# EAGLE design Main Board -v1.1 (EAGLE 7.3.0)
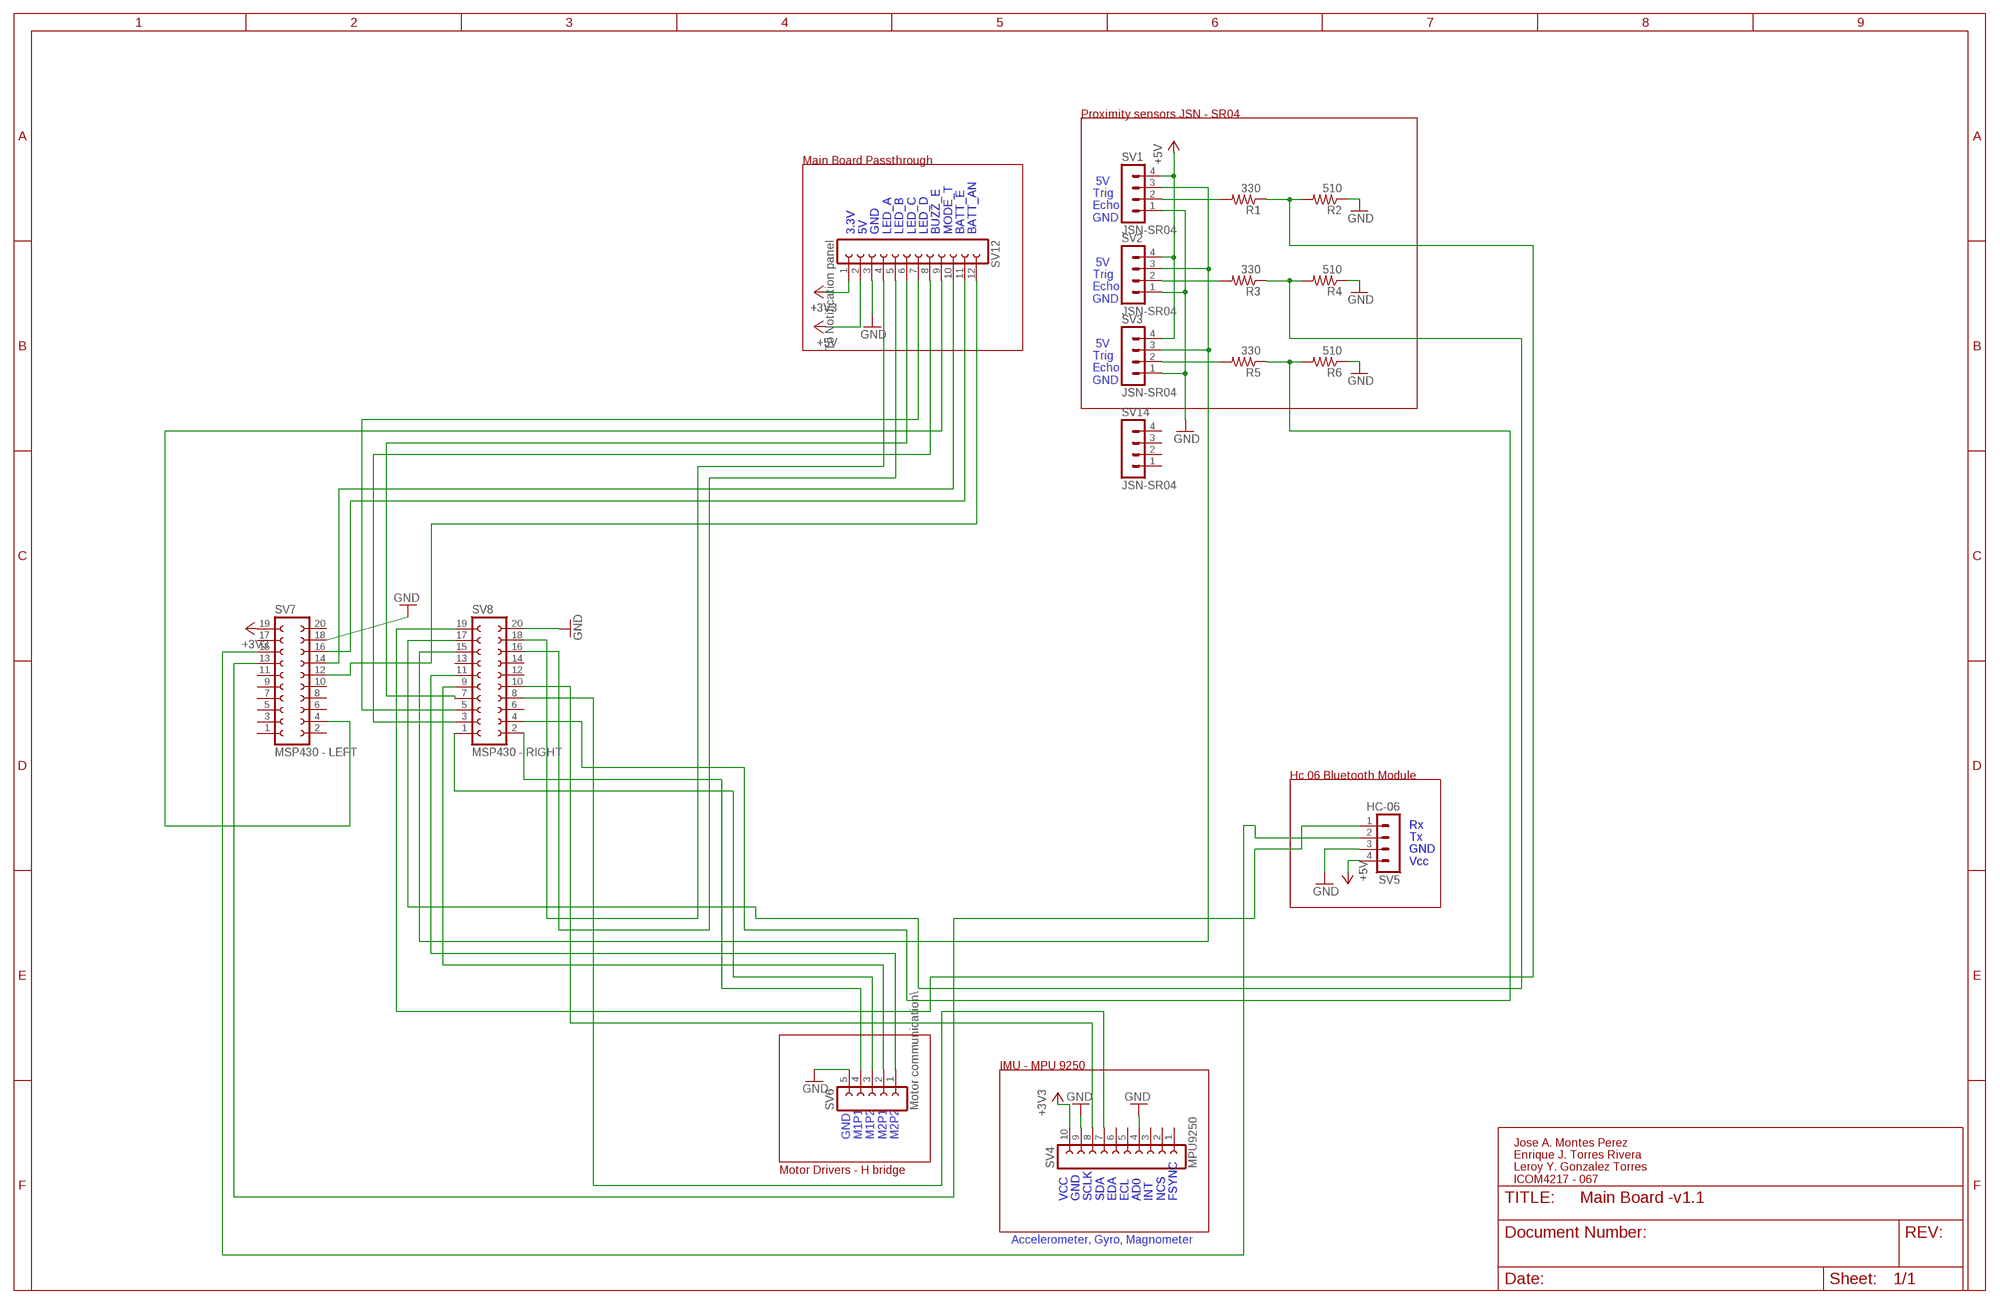
[diagram p0: schematic, sheet 1]

## Parts
R1  330  R-US_0207/10  [0207/10]
R2  510  R-US_0207/10  [0207/10]
R3  330  R-US_0207/10  [0207/10]
R4  510  R-US_0207/10  [0207/10]
R5  330  R-US_0207/10  [0207/10]
R6  510  R-US_0207/10  [0207/10]
SV1  JSN-SR04  MA04-1  [MA04-1]
SV2  JSN-SR04  MA04-1  [MA04-1]
SV3  JSN-SR04  MA04-1  [MA04-1]
SV4  MPU9250  FE10-1  [FE10]
SV5  HC-06  MA04-1  [MA04-1]
SV6  Motor communication\  FE05-1  [FE05-1]
SV7  MSP430 - LEFT  FE10-2  [FE10-2]
SV8  MSP430 - RIGHT  FE10-2  [FE10-2]
SV12  To Notification panel  FE12-1  [FE12]
SV14  JSN-SR04  MA04-1  [MA04-1]

## Nets
+3V3: SV4.10 SV7.19 SV12.1
+5V: SV1.4 SV2.4 SV3.4 SV5.4 SV12.2
GND: R2.1 R4.1 R6.1 SV1.1 SV2.1 SV3.1 SV4.4 SV4.9 SV5.3 SV6.5 SV7.18 SV8.20 SV12.3
N$1: R1.2 SV1.2
N$2: SV7.12 SV12.12
N$4: SV4.8 SV8.10
N$5: R1.1 R2.2 SV8.19
N$6: SV6.4 SV8.2
N$7: R3.2 SV2.2
N$8: SV6.3 SV8.1
N$9: SV7.14 SV12.10
N$10: SV6.2 SV8.9
N$11: SV6.1 SV8.11
N$12: R3.1 R4.2 SV8.17
N$13: SV7.16 SV12.11
N$14: SV4.7 SV8.8
N$15: SV5.1 SV7.13
N$17: R5.2 SV3.2
N$18: SV8.16 SV12.5
N$20: R5.1 R6.2 SV8.4
N$21: SV8.18 SV12.4
N$24: SV1.3 SV2.3 SV3.3 SV8.15
N$25: SV8.3 SV12.8
N$26: SV5.2 SV7.15
N$27: SV8.5 SV12.7
N$28: SV8.7 SV12.6
N$30: SV7.4 SV12.9
Unconnected: SV4.1 SV4.2 SV4.3 SV4.5 SV4.6 SV7.1 SV7.2 SV7.3 SV7.5 SV7.6 SV7.7 SV7.8 SV7.9 SV7.10 SV7.11 SV7.17 SV7.20 SV8.6 SV8.12 SV8.13 SV8.14 SV14.1 SV14.2 SV14.3 SV14.4

## Notes on the sheet
- Proximity sensors JSN - SR04
- Main Board Passthrough
- 5V
  Trig
  Echo
  GND
- 3.3V
  5V
  GND
  LED_A
  LED_B
  LED_C
  LED_D
  BUZZ_E
  MODE_T
  BATT_E
  BATT_AN
- 5V
  Trig
  Echo
  GND
- 5V
  Trig
  Echo
  GND
- Hc 06 Bluetooth Module
- Rx
  Tx
  GND
  Vcc
- IMU - MPU 9250
- GND
  M1P1
  M1P2
  M2P1
  M2P2
- Motor Drivers - H bridge
- Jose A. Montes Perez
  Enrique J. Torres Rivera
  Leroy Y. Gonzalez Torres
  ICOM4217 - 067
- VCC
  GND
  SCLK
  SDA
  EDA
  ECL
  AD0
  INT
  NCS
  FSYNC
- Accelerometer, Gyro, Magnometer

## Library data of the parts
R1-R6 = resistor:R-US_: RESISTOR, American symbol
SV1-SV3 SV5 SV14 = con-lstb:MA04-1: PIN HEADER; OC_FARNELL: unknown; OC_NEWARK: unknown
SV4 = con-lsta:FE10-1: FEMALE HEADER; OC_FARNELL: unknown; OC_NEWARK: unknown
SV6 = con-lsta:FE05-1: FEMALE HEADER; OC_FARNELL: unknown; OC_NEWARK: unknown
SV7 SV8 = con-lsta:FE10-2: FEMALE HEADER; OC_FARNELL: unknown; OC_NEWARK: unknown
SV12 = con-lsta:FE12-1: FEMALE HEADER; OC_FARNELL: unknown; OC_NEWARK: unknown

## Board
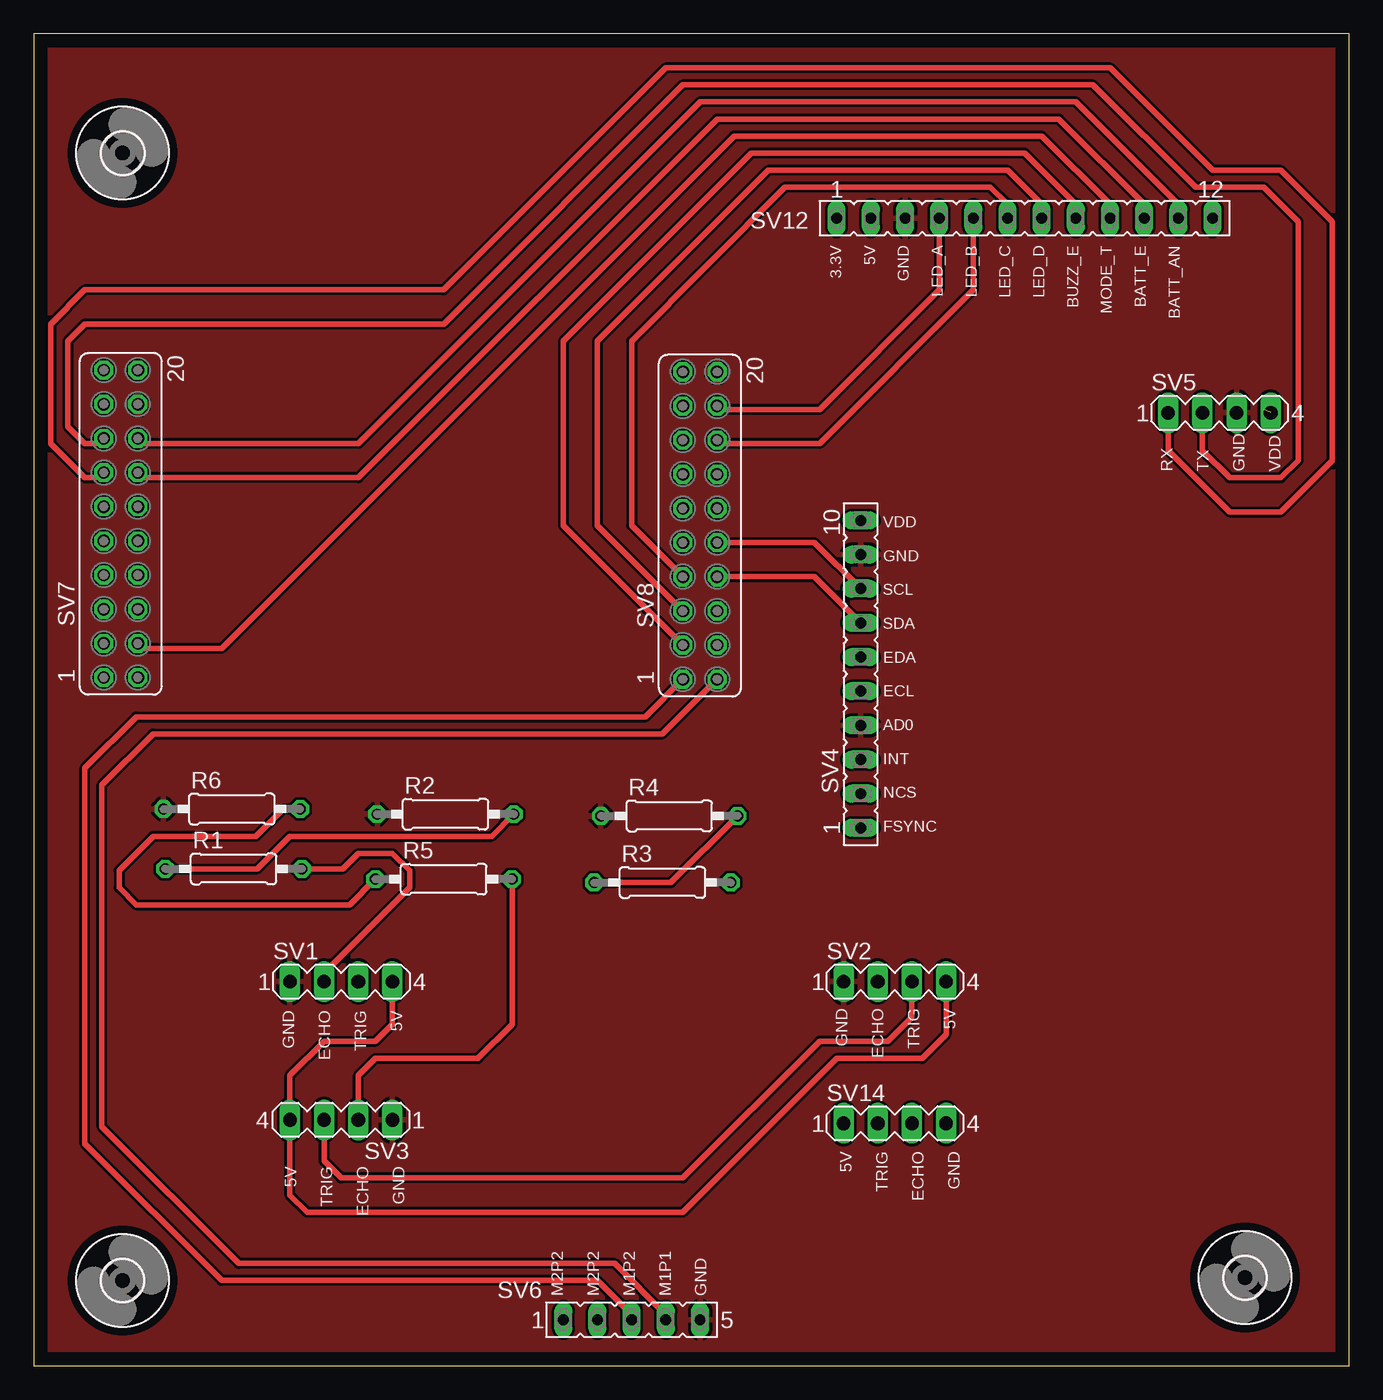
[diagram p1: board, top side]
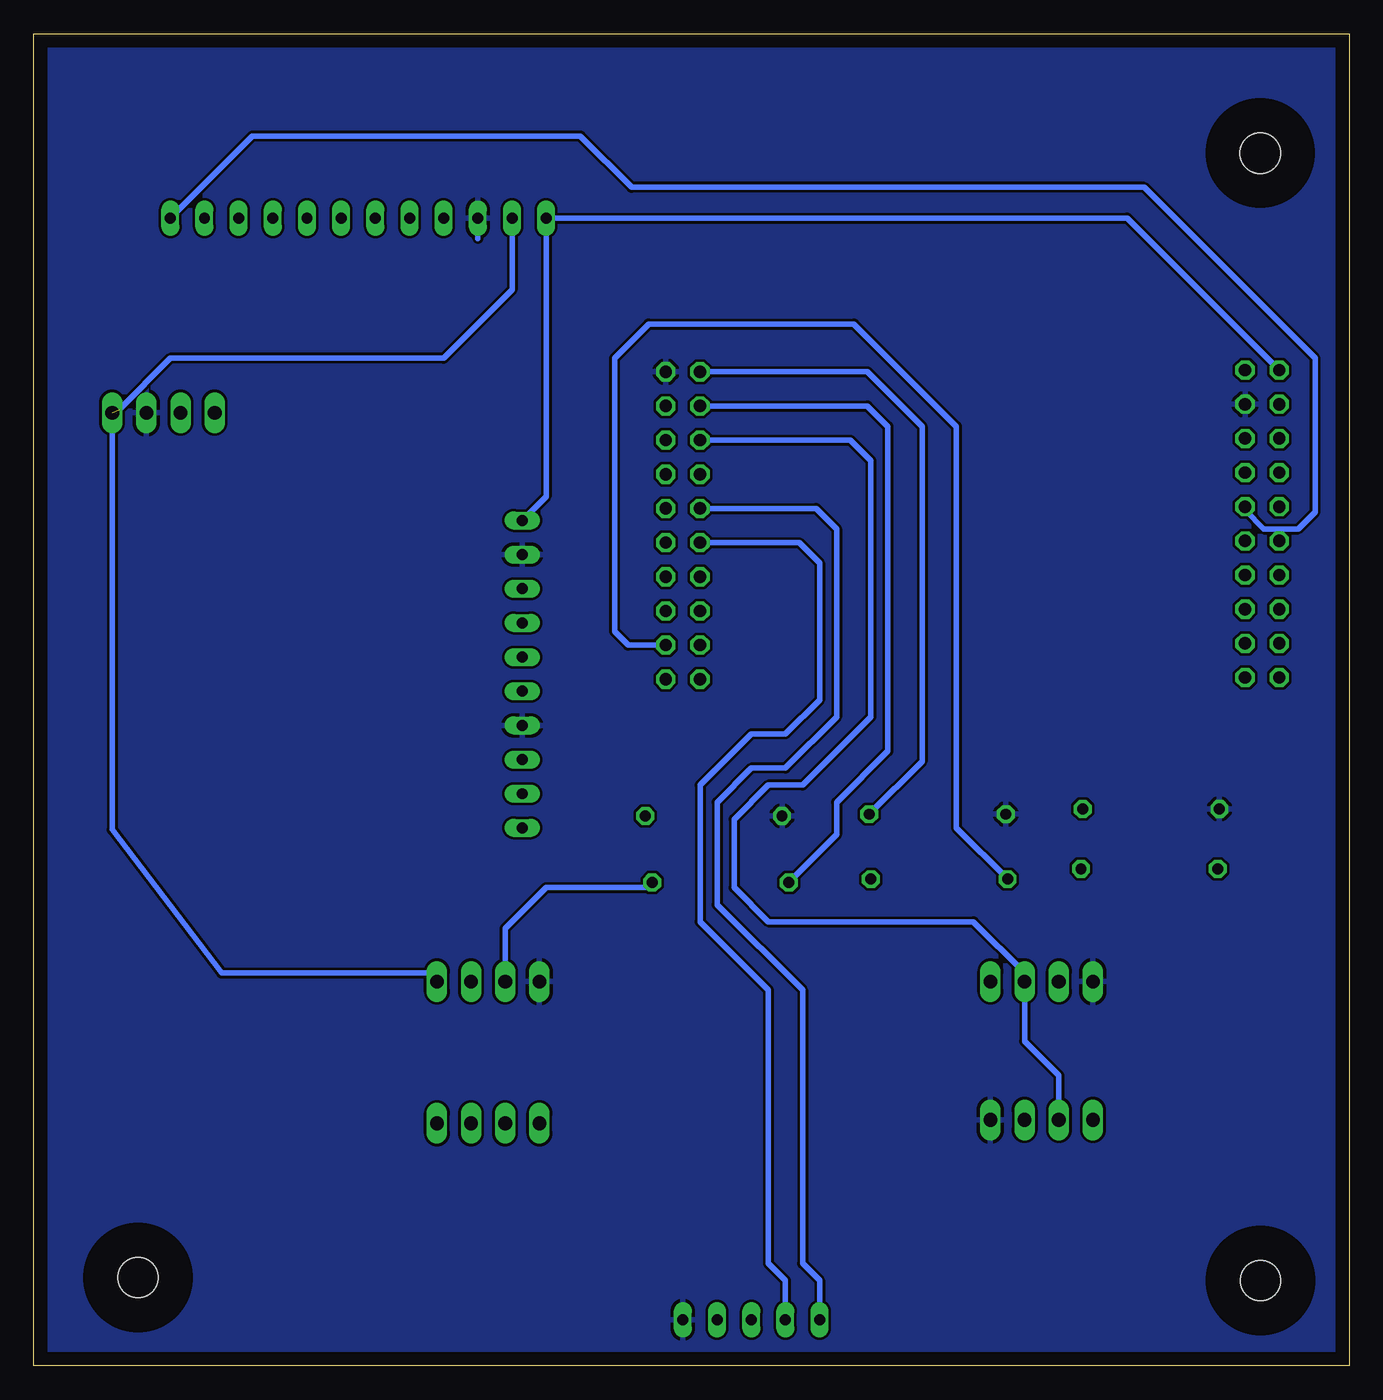
[diagram p2: board, bottom side, seen from below]

Size 97.79 x 99.06 mm. Coordinates in mm from the lower left corner, seen from the top.
Outline: 0,99.06 0,0 97.79,0 97.79,99.06 0,99.06
Copper layers (1*16): Top 0.035mm / dielectric 1.5mm / Bottom 0.035mm
Design rules "default": minimum track width 10mil, minimum drill 24mil, track to track 8mil, track to pad 8mil, pad to pad 8mil, via to via 8mil, smd to smd 8mil, copper to edge 40mil, drill to drill 8mil, minimum pad ring 10mil, minimum via ring 8mil, stop-mask expansion 4mil, vias tented up to drill 0mil, thermal gap 10mil

### Footprints (pad centres in the part's own frame; a part is rotated, then mirrored left to right if it is on the bottom)
0207/10 = drill 0.813 octagon: 1 -5.08,0; 2 5.08,0
MA04-1 = drill 1.016 long: 1 -3.81,0; 2 -1.27,0; 3 1.27,0; 4 3.81,0
FE10 = drill 0.813 long: 1 -11.43,0; 2 -8.89,0; 3 -6.35,0; 4 -3.81,0; 5 -1.27,0; 6 1.27,0; 7 3.81,0; 8 6.35,0; 9 8.89,0; 10 11.43,0
FE05-1 = drill 0.813 long: 1 -5.08,0; 2 -2.54,0; 3 0,0; 4 2.54,0; 5 5.08,0
FE10-2 = drill 0.914 octagon: 1 -11.43,1.27; 2 -11.43,-1.27; 3 -8.89,1.27; 4 -8.89,-1.27; 5 -6.35,1.27; 6 -6.35,-1.27; 7 -3.81,1.27; 8 -3.81,-1.27; 9 -1.27,1.27; 10 -1.27,-1.27; 11 1.27,1.27; 12 1.27,-1.27; 13 3.81,1.27; 14 3.81,-1.27; 15 6.35,1.27; 16 6.35,-1.27; 17 8.89,1.27; 18 8.89,-1.27; 19 11.43,1.27; 20 11.43,-1.27
FE12 = drill 0.813 long: 1 -13.97,0; 2 -11.43,0; 3 -8.89,0; 4 -6.35,0; 5 -3.81,0; 6 -1.27,0; 7 1.27,0; 8 3.81,0; 9 6.35,0; 10 8.89,0; 11 11.43,0; 12 13.97,0
3,0 = hole 3: 0,0

### Placement (x,y rotation side)
R1  14.86,36.96 0 top
R2  30.61,41.02 0 top
R3  46.74,35.94 0 top
R4  47.24,40.89 0 top
R5  30.48,36.2 0 top
R6  14.73,41.4 0 top
SV1  22.86,28.57 0 top
SV2  64.01,28.57 0 top
SV3  22.86,18.29 180 top
SV4  61.47,51.43 90 top
SV5  88.14,70.87 0 top
SV6  44.45,3.43 0 top
SV7  6.48,62.61 90 top
SV8  49.53,62.48 90 top
SV12  73.66,85.34 0 top
SV14  64.01,18.03 0 top
U$1  [3,0]  6.62,90.18 0 top
U$2  [3,0]  90.04,6.56 0 top
U$3  [3,0]  6.6,6.35 0 top

### Tracks (layer width: path | path; a pad name or v marks a point on that pad's centre or on a via)
+3V3
  Bottom 0.406: SV4.10 59.69,64.64 SV12.1 16.51,85.34 SV7.19
+5V  (1 unrouted)
  Top 0.406: SV1.4 26.67,25.4 25.4,24.13 21.59,24.13 19.05,21.59 SV3.4 19.05,12.7 20.32,11.43 48.26,11.43 59.69,22.86 66.04,22.86 67.82,24.64 SV2.4
  Bottom 0.406: SV12.2 62.23,80.01 67.31,74.93 87.63,74.93 91.44,71.12 | SV5.4 91.95,39.88 83.82,29.21 68.45,29.21 SV2.4
GND
  pour Bottom: 0,0 97.79,0 97.79,99.06 0,99.06
  pour Top (isolate 0.012): 0,99.06 97.79,99.06 97.79,0 0,0
N$1
  Top 0.406: R1.2 22.99,36.96 24.13,38.1 26.67,38.1 27.94,36.83 27.94,35.56 21.59,29.21 SV1.2
N$2
  Bottom 0.406: SV7.12 7.75,63.63 6.35,62.23 3.81,62.23 2.54,63.5 2.54,74.93 15.24,87.63 53.34,87.63 57.15,91.44 81.53,91.44 SV12.12
N$3
  Bottom 0.406: 64.77,83.82 64.77,85.09
N$4
  Top 0.406: SV8.10 58.04,61.21 SV4.8
N$5
  Top 0.406: R1.1 16.64,36.96 19.05,39.37 34.04,39.37 R2.2
  Bottom 0.406: SV8.19 35.81,73.91 31.75,69.85 31.75,44.96 R2.2
N$6
  Top 0.406: SV6.4 46.99,3.81 43.18,7.62 15.24,7.62 5.08,17.78 5.08,43.18 8.89,46.99 46.74,46.99 SV8.2
N$7
  Bottom 0.406: SV2.2 62.74,32.51 59.69,35.56 52.2,35.56 R3.2
N$8
  Top 0.406: SV6.3 44.45,3.81 41.91,6.35 13.97,6.35 3.81,16.51 3.81,44.45 7.62,48.26 45.47,48.26 SV8.1
N$9
  Top 0.406: SV12.10 82.55,86.36 76.2,92.71 50.8,92.71 24.13,66.04 8.13,66.04 SV7.14
N$10
  Bottom 0.406: SV8.9 40.89,61.21 39.37,59.69 39.37,49.53 41.91,46.99 44.45,46.99 48.26,43.18 48.26,33.02 43.18,27.94 43.18,7.62 41.91,6.35 SV6.2
N$11
  Bottom 0.406: SV8.11 39.62,63.75 38.1,62.23 38.1,48.26 41.91,44.45 44.45,44.45 46.99,41.91 46.99,34.29 40.64,27.94 40.64,7.62 39.37,6.35 SV6.1
N$12
  Top 0.406: R3.1 47.37,35.94 R4.2
  Bottom 0.406: SV8.17 35.81,71.37 34.29,69.85 34.29,45.72 38.1,41.91 38.1,39.5 R3.1
N$13
  Top 0.406: SV12.11 85.09,86.36 77.47,93.98 49.53,93.98 24.13,68.58 8.13,68.58 SV7.16
N$14
  Top 0.406: SV8.8 58.04,58.67 SV4.7
N$15
  Top 0.406: SV5.1 84.33,68.07 88.9,63.5 92.71,63.5 96.52,67.31 96.52,85.09 92.71,88.9 87.63,88.9 80.01,96.52 46.99,96.52 30.48,80.01 3.81,80.01 1.27,77.47 1.27,68.58 3.81,66.04 4.83,66.04 SV7.13
N$17
  Top 0.406: SV3.2 24.13,21.59 25.4,22.86 33.02,22.86 35.56,25.4 R5.2
N$18
  Top 0.406: SV12.5 69.85,80.01 58.42,68.58 51.05,68.58 SV8.16
N$20
  Top 0.406: R6.2 18.54,41.4 16.51,39.37 8.89,39.37 6.35,36.83 6.35,35.56 7.62,34.29 23.5,34.29 R5.1
  Bottom 0.406: SV8.4 53.59,53.59 54.61,54.61 54.61,74.93 52.07,77.47 36.83,77.47 29.21,69.85 29.21,40 R5.1
N$21
  Top 0.406: SV12.4 67.31,80.01 58.42,71.12 51.05,71.12 SV8.18
N$24
  Top 0.406: SV2.3 65.28,25.91 63.5,24.13 58.42,24.13 48.26,13.97 22.86,13.97 21.59,15.24 SV3.3
  Bottom 0.406: SV8.15 37.08,68.83 35.56,67.31 35.56,48.26 40.64,43.18 43.18,43.18 45.72,40.64 45.72,35.56 43.18,33.02 27.94,33.02 24.13,29.21 SV1.3 24.13,24.13 21.59,21.59 SV3.3
N$25
  Top 0.406: SV12.8 77.47,86.36 73.66,90.17 53.34,90.17 39.37,76.2 39.37,62.48 SV8.3
N$26
  Top 0.406: SV5.2 86.87,68.07 88.9,66.04 92.71,66.04 93.98,67.31 93.98,85.09 91.44,87.63 86.36,87.63 78.74,95.25 48.26,95.25 30.48,77.47 3.81,77.47 2.54,76.2 2.54,69.85 3.81,68.58 4.83,68.58 SV7.15
N$27
  Top 0.406: SV12.7 74.93,86.36 72.39,88.9 54.61,88.9 41.91,76.2 41.91,62.48 SV8.5
N$28
  Top 0.406: 72.39,85.09 SV12.6 72.39,86.36 71.12,87.63 55.83,87.63 44.45,76.2 44.45,62.48 SV8.7
N$30
  Top 0.406: SV12.9 80.01,86.36 74.93,91.44 52.07,91.44 13.97,53.34 8.13,53.34 SV7.4

### Text on the board
tPlace: RX / / TX / / GND / / VDD
tNames: 3.3V / / 5V / / GND / / LED_A / / LED_B / / LED_C / / LED_D / / BUZZ_E / / MODE_T / / BATT_E / / BATT_AN | VDD / / GND / / SCL / / SDA / / EDA / / ECL / / AD0 / / INT / / NCS / / FSYNC | GND / / ECHO / / TRIG / / 5V | GND / / ECHO / / TRIG / / 5V | 5V / / TRIG / / ECHO / / GND | 5V / / TRIG / / ECHO / / GND | M2P2 / / M2P2 / / M1P2 / / M1P1 / / GND
200bmp: Jose A. Montes Perez / Enrique J. Torres Rivera / Leroy Y. Gonzalez Torres / ICOM 4217